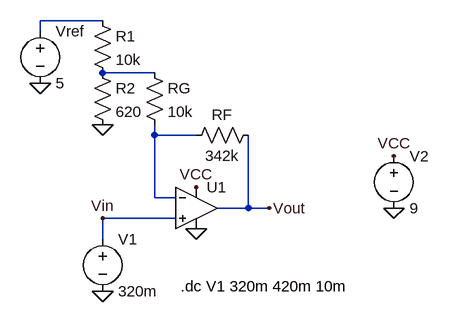
[diagram p0: schematic LM35_amp.asc]
LM35_amp.asc, the LTspice schematic file:
Version 4
SHEET 1 880 680
WIRE 64 -16 -32 -16
WIRE -32 0 -32 -16
WIRE 144 64 64 64
WIRE 144 160 144 144
WIRE 208 160 144 160
WIRE 144 256 144 160
WIRE 176 256 144 256
WIRE 288 272 288 160
WIRE 288 272 240 272
WIRE 320 272 288 272
WIRE 176 288 64 288
WIRE 64 320 64 288
FLAG 64 400 0
FLAG 208 304 0
FLAG 208 240 VCC
FLAG 320 272 Vout
FLAG 64 288 Vin
FLAG 512 272 0
FLAG 64 144 0
FLAG -32 80 0
FLAG 512 192 VCC
SYMBOL Voltage 64 304 R0
SYMATTR InstName V1
SYMATTR Value 320m
SYMBOL OpAmps/UniversalOpAmp 208 272 R0
SYMATTR InstName U1
SYMBOL Voltage 512 176 R0
SYMATTR InstName V2
SYMATTR Value 9
SYMBOL Res 128 48 R0
SYMATTR InstName RG
SYMATTR Value 10k
SYMBOL Res 48 48 R0
SYMATTR InstName R2
SYMATTR Value 620
SYMBOL Res 48 -32 R0
SYMATTR InstName R1
SYMATTR Value 10k
SYMBOL Voltage -32 -16 R0
SYMATTR InstName Vref
SYMATTR Value 5
SYMBOL Res 304 144 R90
WINDOW 0 0 56 VBottom 2
WINDOW 3 32 56 VTop 2
SYMATTR InstName RF
SYMATTR Value 342k
TEXT 184 392 Left 2 !.dc V1 320m 420m 10m

The netlist it stands for:
* LM35_amp.asc
V1 Vin 0 320m
XU1 Vin N003 VCC 0 Vout level1 Avol=1Meg GBW=10Meg Vos=0 En=0 Enk=0 In=0 Ink=0 Rin=500Meg  ; pins In+ In- V+ V- OUT
V2 VCC 0 9
RG N002 N003 10k
R2 N002 0 620
R1 N001 N002 10k
Vref N001 0 5
RF Vout N003 342k
.dc V1 320m 420m 10m
.lib UniversalOpAmp1.lib
.backanno
.end